# Altium project PA_8CH_CTRL.PrjPcb (part 3 of 3)
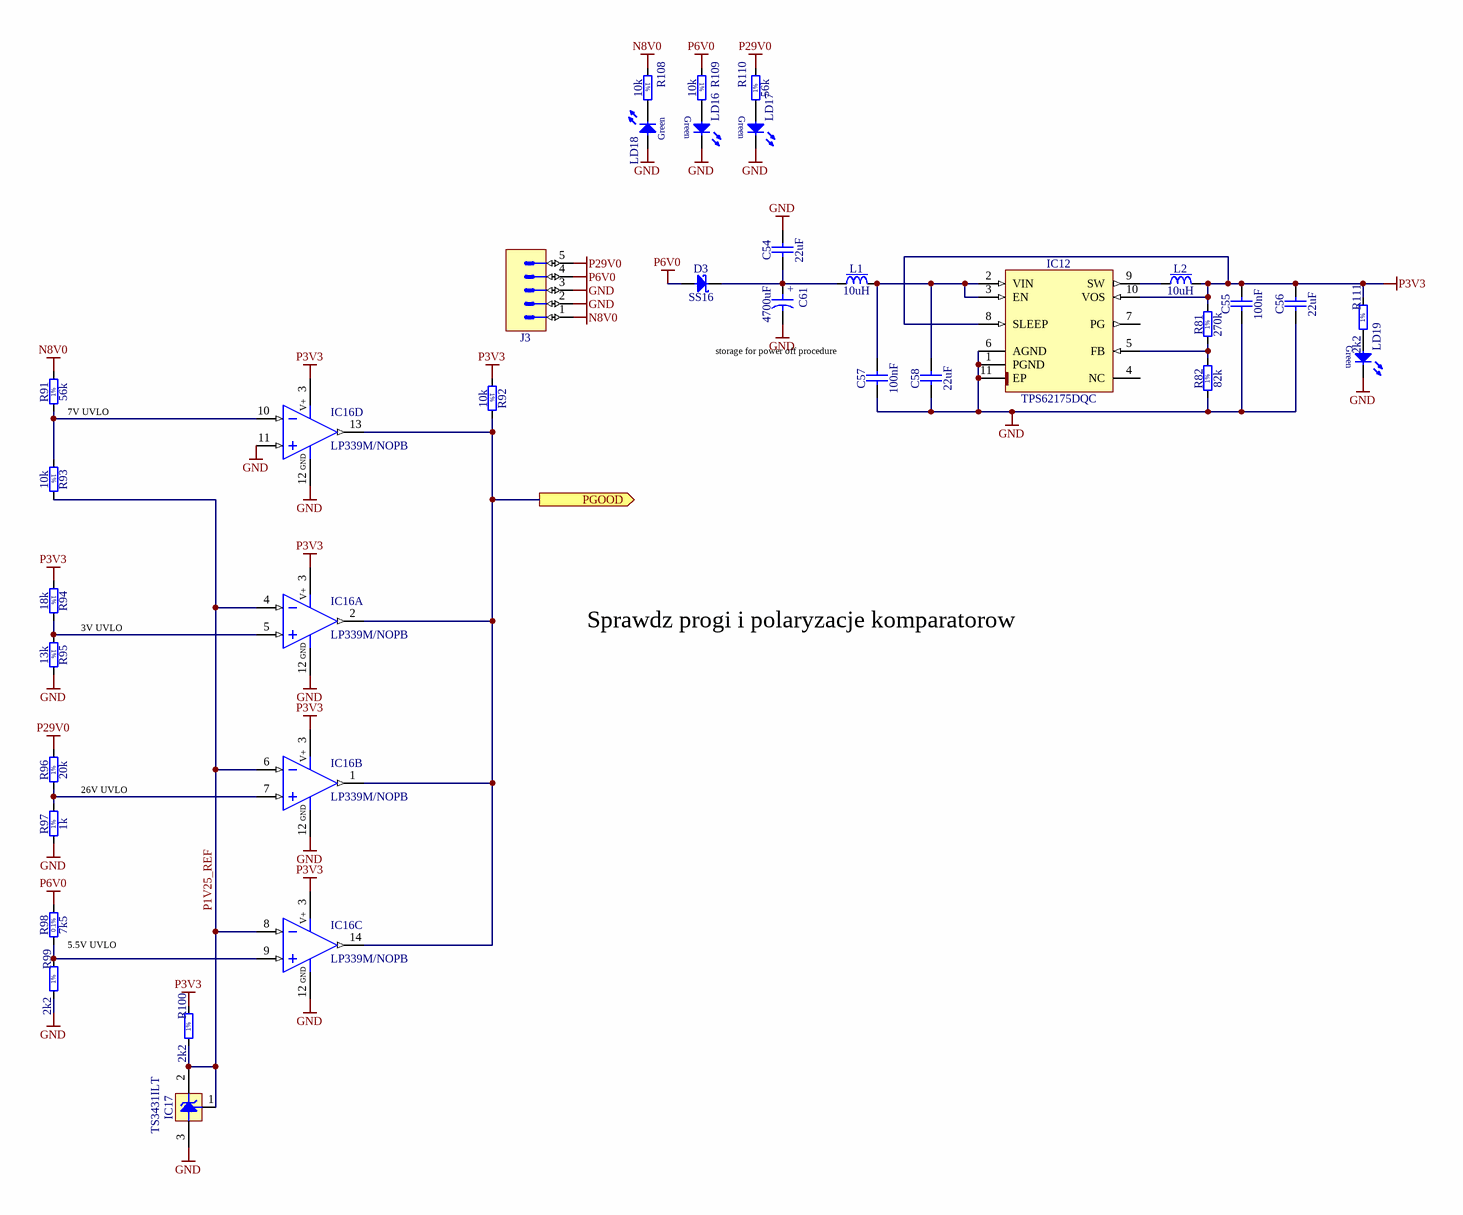
[diagram p6: Power_Supply.SchDoc]

## Nets that join several sheets
GND: PA_CTRL_TOP (39 pins), ETH_IFC (24 pins), CPU (38 pins), U_PA_Channel (42 pins), U_PA_Channel (42 pins), U_PA_Channel (42 pins), U_PA_Channel (42 pins), U_PA_Channel (42 pins), U_PA_Channel (42 pins), U_PA_Channel (42 pins), U_PA_Channel (42 pins), LEDs (27 pins), Power_Supply (22 pins)
N8V0: U_PA_Channel (C42_1.2 IC13_1.2), U_PA_Channel (C42_2.2 IC13_2.2), U_PA_Channel (C42_3.2 IC13_3.2), U_PA_Channel (C42_4.2 IC13_4.2), U_PA_Channel (C42_5.2 IC13_5.2), U_PA_Channel (C42_6.2 IC13_6.2), U_PA_Channel (C42_7.2 IC13_7.2), U_PA_Channel (C42_8.2 IC13_8.2), Power_Supply (J3.1 R91.2 R108.1)
P3V3: PA_CTRL_TOP (26 pins), ETH_IFC (8 pins), CPU (33 pins), U_PA_Channel (16 pins), U_PA_Channel (16 pins), U_PA_Channel (16 pins), U_PA_Channel (16 pins), U_PA_Channel (16 pins), U_PA_Channel (16 pins), U_PA_Channel (16 pins), U_PA_Channel (16 pins), LEDs (6 pins), Power_Supply (11 pins)
P6V0: U_PA_Channel (C35_1.2 R42_1.1 T3_1.2), U_PA_Channel (C35_2.2 R42_2.1 T3_2.2), U_PA_Channel (C35_3.2 R42_3.1 T3_3.2), U_PA_Channel (C35_4.2 R42_4.1 T3_4.2), U_PA_Channel (C35_5.2 R42_5.1 T3_5.2), U_PA_Channel (C35_6.2 R42_6.1 T3_6.2), U_PA_Channel (C35_7.2 R42_7.1 T3_7.2), U_PA_Channel (C35_8.2 R42_8.1 T3_8.2), Power_Supply (D3.2 J3.4 R98.2 R109.1)
P29V0: U_PA_Channel (C32_1.2 R40_1.2 T1_1.2), U_PA_Channel (C32_2.2 R40_2.2 T1_2.2), U_PA_Channel (C32_3.2 R40_3.2 T1_3.2), U_PA_Channel (C32_4.2 R40_4.2 T1_4.2), U_PA_Channel (C32_5.2 R40_5.2 T1_5.2), U_PA_Channel (C32_6.2 R40_6.2 T1_6.2), U_PA_Channel (C32_7.2 R40_7.2 T1_7.2), U_PA_Channel (C32_8.2 R40_8.2 T1_8.2), Power_Supply (J3.5 R96.2 R110.2)
ADC_IN0: CPU (IC1.34), U_PA_Channel (CON1_1.5)
ADC_IN1: CPU (IC1.35), U_PA_Channel (CON1_1.10)
ADC_IN2: CPU (IC1.36), U_PA_Channel (CON1_2.5)
ADC_IN3: CPU (IC1.37), U_PA_Channel (CON1_2.10)
ADC_IN4: CPU (IC1.18), U_PA_Channel (CON1_3.5)
ADC_IN5: CPU (IC1.19), U_PA_Channel (CON1_3.10)
ADC_IN6: CPU (IC1.20), U_PA_Channel (CON1_4.5)
ADC_IN7: CPU (IC1.21), U_PA_Channel (CON1_4.10)
ADC_IN8: CPU (IC1.22), U_PA_Channel (CON1_5.5)
ADC_IN9: CPU (IC1.13), U_PA_Channel (CON1_5.10)
ADC_IN10: CPU (IC1.26), U_PA_Channel (CON1_6.5)
ADC_IN11: CPU (IC1.27), U_PA_Channel (CON1_6.10)
ADC_IN12: CPU (IC1.28), U_PA_Channel (CON1_7.5)
ADC_IN13: CPU (IC1.29), U_PA_Channel (CON1_7.10)
ADC_IN14: CPU (IC1.14), U_PA_Channel (CON1_8.5)
ADC_IN15: CPU (IC1.15), U_PA_Channel (CON1_8.10)
ALERT: CPU (IC1.77), U_PA_Channel (IC9_1.2 LD15_1.1 R57_1.1)
ALERT: CPU (IC1.78), U_PA_Channel (IC9_2.2 LD15_2.1 R57_2.1)
ALERT: CPU (IC1.79), U_PA_Channel (IC9_3.2 LD15_3.1 R57_3.1)
ALERT: CPU (IC1.80), U_PA_Channel (IC9_4.2 LD15_4.1 R57_4.1)
ALERT: CPU (IC1.81), U_PA_Channel (IC9_5.2 LD15_5.1 R57_5.1)
ALERT: CPU (IC1.82), U_PA_Channel (IC9_6.2 LD15_6.1 R57_6.1)
ALERT: CPU (IC1.85), U_PA_Channel (IC9_7.2 LD15_7.1 R57_7.1)
ALERT: CPU (IC1.86), U_PA_Channel (IC9_8.2 LD15_8.1 R57_8.1)
EN_PWR_CH0: CPU (IC1.114), U_PA_Channel (R85_1.2 R88_1.2)
EN_PWR_CH1: CPU (IC1.115), U_PA_Channel (R85_2.2 R88_2.2)
EN_PWR_CH2: CPU (IC1.116), U_PA_Channel (R85_3.2 R88_3.2)
EN_PWR_CH3: CPU (IC1.117), U_PA_Channel (R85_4.2 R88_4.2)
EN_PWR_CH4: CPU (IC1.118), U_PA_Channel (R85_5.2 R88_5.2)
EN_PWR_CH5: CPU (IC1.119), U_PA_Channel (R85_6.2 R88_6.2)
EN_PWR_CH6: CPU (IC1.122), U_PA_Channel (R85_7.2 R88_7.2)
EN_PWR_CH7: CPU (IC1.123), U_PA_Channel (R85_8.2 R88_8.2)
I2C0_SCL: PA_CTRL_TOP (IC11.2 R63.1), U_PA_Channel (CON1_1.9 IC9_1.3 IC15_1.5)
I2C0_SDA: PA_CTRL_TOP (IC11.1 R61.1), U_PA_Channel (CON1_1.4 IC9_1.4 IC15_1.4)
I2C1_SCL: PA_CTRL_TOP (IC11.4 R65.1), U_PA_Channel (CON1_2.9 IC9_2.3 IC15_2.5)
I2C1_SDA: PA_CTRL_TOP (IC11.3 R64.1), U_PA_Channel (CON1_2.4 IC9_2.4 IC15_2.4)
I2C2_SCL: PA_CTRL_TOP (IC11.6 R70.1), U_PA_Channel (CON1_3.9 IC9_3.3 IC15_3.5)
I2C2_SDA: PA_CTRL_TOP (IC11.5 R68.1), U_PA_Channel (CON1_3.4 IC9_3.4 IC15_3.4)
I2C3_SCL: PA_CTRL_TOP (IC11.8 R72.1), U_PA_Channel (CON1_4.9 IC9_4.3 IC15_4.5)
I2C3_SDA: PA_CTRL_TOP (IC11.7 R71.1), U_PA_Channel (CON1_4.4 IC9_4.4 IC15_4.4)
I2C4_SCL: PA_CTRL_TOP (IC11.11 R74.1), U_PA_Channel (CON1_5.9 IC9_5.3 IC15_5.5)
I2C4_SDA: PA_CTRL_TOP (IC11.10 R73.1), U_PA_Channel (CON1_5.4 IC9_5.4 IC15_5.4)
I2C5_SCL: PA_CTRL_TOP (IC11.13 R76.1), U_PA_Channel (CON1_6.9 IC9_6.3 IC15_6.5)
I2C5_SDA: PA_CTRL_TOP (IC11.12 R75.1), U_PA_Channel (CON1_6.4 IC9_6.4 IC15_6.4)
I2C6_SCL: PA_CTRL_TOP (IC11.15 R78.1), U_PA_Channel (CON1_7.9 IC9_7.3 IC15_7.5)
I2C6_SDA: PA_CTRL_TOP (IC11.14 R77.1), U_PA_Channel (CON1_7.4 IC9_7.4 IC15_7.4)
I2C7_SCL: PA_CTRL_TOP (IC11.17 R80.1), U_PA_Channel (CON1_8.9 IC9_8.3 IC15_8.5)
I2C7_SDA: PA_CTRL_TOP (IC11.16 R79.1), U_PA_Channel (CON1_8.4 IC9_8.4 IC15_8.4)
I2C_SCL: PA_CTRL_TOP (IC11.19 J2.23 R62.2), CPU (IC1.136)
I2C_SDA: PA_CTRL_TOP (IC11.20 J2.24 R60.2), CPU (IC1.137)
Input_overdrive: CPU (IC1.59), U_PA_Channel (CON1_1.3)
Input_overdrive: CPU (IC1.60), U_PA_Channel (CON1_2.3)
Input_overdrive: CPU (IC1.63), U_PA_Channel (CON1_3.3)
Input_overdrive: CPU (IC1.64), U_PA_Channel (CON1_4.3)
Input_overdrive: CPU (IC1.65), U_PA_Channel (CON1_5.3)
Input_overdrive: CPU (IC1.66), U_PA_Channel (CON1_6.3)
Input_overdrive: CPU (IC1.67), U_PA_Channel (CON1_7.3)
Input_overdrive: CPU (IC1.68), U_PA_Channel (CON1_8.3)
INT: PA_CTRL_TOP (J4.12), ETH_IFC (U1.36)
LED_CS: PA_CTRL_TOP (J4.14), LEDs (IC3.12 IC4.12 IC5.12)
LED_OEn: PA_CTRL_TOP (J4.18), LEDs (IC3.13 IC4.13 IC5.13)
LED_SCK: PA_CTRL_TOP (J4.16), LEDs (IC3.11 IC4.11 IC5.11)
LED_SDI: PA_CTRL_TOP (J4.17), LEDs (IC3.14)
NetD2_1_1: CPU (IC1.89), U_PA_Channel (D2_1.1), U_PA_Channel (D2_2.1), U_PA_Channel (D2_3.1), U_PA_Channel (D2_4.1), U_PA_Channel (D2_5.1), U_PA_Channel (D2_6.1), U_PA_Channel (D2_7.1), U_PA_Channel (D2_8.1), Power_Supply (5 pins)
NetIC1_40: PA_CTRL_TOP (J2.2), CPU (IC1.40)
NetIC1_41: PA_CTRL_TOP (J2.4), CPU (IC1.41)
NetIC1_42: PA_CTRL_TOP (J2.8), CPU (IC1.42)
NetIC1_43: PA_CTRL_TOP (J2.6), CPU (IC1.43)
NetIC1_73: PA_CTRL_TOP (J2.14), CPU (IC1.73)
NetIC1_74: PA_CTRL_TOP (J2.16), CPU (IC1.74)
NetIC1_76: PA_CTRL_TOP (J2.17), CPU (IC1.76)
NetIC1_90: PA_CTRL_TOP (J2.10), CPU (IC1.90)
NetIC1_91: PA_CTRL_TOP (J2.12), CPU (IC1.91)
NetIC1_102: PA_CTRL_TOP (J2.29), CPU (IC1.102)
NetIC1_103: PA_CTRL_TOP (J2.27), CPU (IC1.103)
NetIC1_104: PA_CTRL_TOP (J2.28), CPU (IC1.104)
NetIC1_139: PA_CTRL_TOP (J2.18), CPU (IC1.139)
NetJ2_26: PA_CTRL_TOP (J2.26), CPU (R3.2)
P2V5_REF: PA_CTRL_TOP (C52.1 IC10.2), CPU (FB2.2), U_PA_Channel (C51_1.1 IC9_1.15), U_PA_Channel (C51_2.1 IC9_2.15), U_PA_Channel (C51_3.1 IC9_3.15), U_PA_Channel (C51_4.1 IC9_4.15), U_PA_Channel (C51_5.1 IC9_5.15), U_PA_Channel (C51_6.1 IC9_6.15), U_PA_Channel (C51_7.1 IC9_7.15), U_PA_Channel (C51_8.1 IC9_8.15)
PA_CH_RESETn: CPU (IC1.140), U_PA_Channel (IC9_1.1), U_PA_Channel (IC9_2.1), U_PA_Channel (IC9_3.1), U_PA_Channel (IC9_4.1), U_PA_Channel (IC9_5.1), U_PA_Channel (IC9_6.1), U_PA_Channel (IC9_7.1), U_PA_Channel (IC9_8.1)
PA_SIG_GND: CPU (R83.2), U_PA_Channel (CON1_1.15), U_PA_Channel (CON1_2.15), U_PA_Channel (CON1_3.15), U_PA_Channel (CON1_4.15), U_PA_Channel (CON1_5.15), U_PA_Channel (CON1_6.15), U_PA_Channel (CON1_7.15), U_PA_Channel (CON1_8.15)
RESETn: PA_CTRL_TOP (J4.10), ETH_IFC (U1.37)
SIG_ON_CH0: CPU (IC1.93), U_PA_Channel (R50_1.1 R84_1.2)
SIG_ON_CH1: CPU (IC1.124), U_PA_Channel (R50_2.1 R84_2.2)
SIG_ON_CH2: CPU (IC1.125), U_PA_Channel (R50_3.1 R84_3.2)
SIG_ON_CH3: CPU (IC1.126), U_PA_Channel (R50_4.1 R84_4.2)
SIG_ON_CH4: CPU (IC1.127), U_PA_Channel (R50_5.1 R84_5.2)
SIG_ON_CH5: CPU (IC1.128), U_PA_Channel (R50_6.1 R84_6.2)
SIG_ON_CH6: CPU (IC1.129), U_PA_Channel (R50_7.1 R84_7.2)
SIG_ON_CH7: CPU (IC1.132), U_PA_Channel (R50_8.1 R84_8.2)
SPI1_MISO: PA_CTRL_TOP (J4.8), ETH_IFC (U1.34)
SPI1_MOSI: PA_CTRL_TOP (J4.6), ETH_IFC (U1.35)
SPI1_NSS: PA_CTRL_TOP (J4.2), ETH_IFC (U1.32)
SPI1_SCK: PA_CTRL_TOP (J4.4), ETH_IFC (U1.33)
SWn1: PA_CTRL_TOP (J2.19), CPU (IC1.54 R112.1)
SWn2: PA_CTRL_TOP (J2.20), CPU (IC1.55 R113.1)